# Altium schematic sheet april-demo.SchDoc: April Demos
size Letter; CompanyName: Electric Imp; Address1: Electric Imp; Address2: 5050 El Camino Real, #221; Address3: Los Altos, CA 94022; Address4: United States; Revision: 1; SheetNumber: 1; SheetTotal: 1; PageSetup: Record=PageOptions|CenterHorizontal=True|CenterVertical=True|PrintScale=0.22|XCorrection=1.00|YCorrection=1.00|PrintKind=0|BorderSize=5000000|LeftOffset=0|BottomOffset=0|Orientation=2|PaperLength=1000|PaperWidth=1000|Scale=100|PaperSource=7|PrintQuality=600|MediaType=1|DitherType=10|PaperKind=Tabloid|PrintScaleMode=1
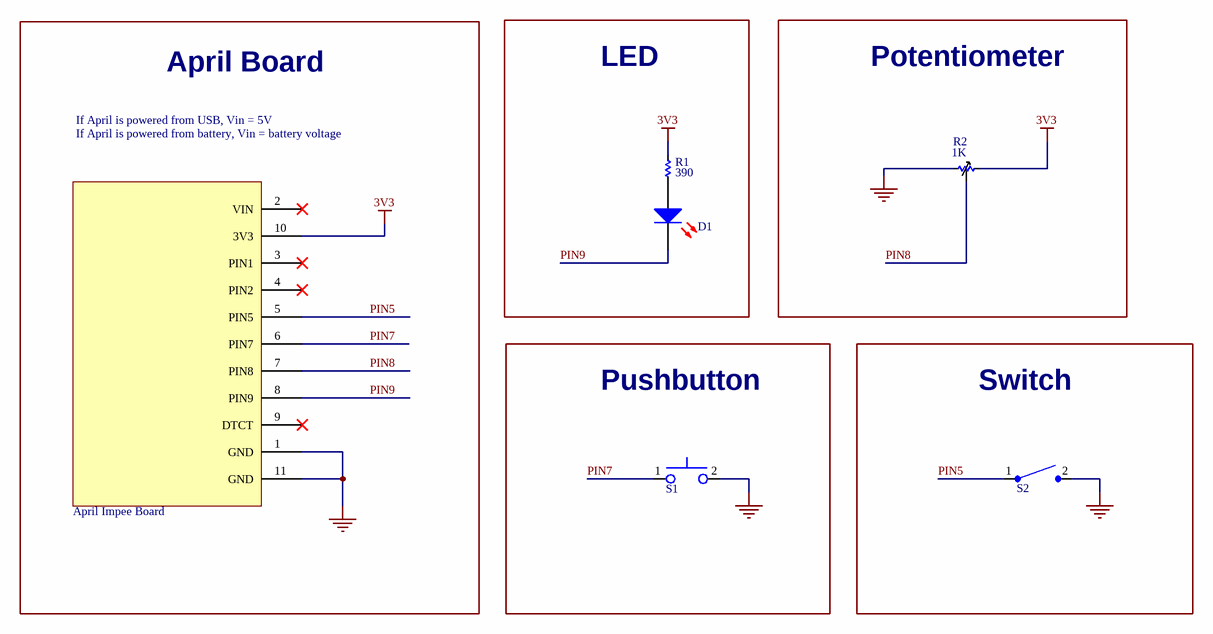
[diagram p0: april-demo.SchDoc]

## Parts
D1  LED Red  (value not drawn)
J1  April Impee Board
R1  value 390  (hidden comment: Resistor)
R2  value 1K  (hidden comment: Potentiometer)
S1  BUTTON  (value not drawn)
S2  SWITCH  (value not drawn)

## Blocks framed on the sheet
April Board: J1
LED: D1 R1
Potentiometer: R2
Pushbutton: S1
Switch: S2

## Nets
3V3: J1.10(3V3) R1.2 R2.3
GND: J1.1(GND) J1.11(GND) R2.1 S1.2(PIN2) S2.2(PIN2)
PIN5: J1.5(PIN5) S2.1(PIN1)
PIN7: J1.6(PIN7) S1.1(PIN1)
PIN8: J1.7(PIN8) R2.2
PIN9: D1.K J1.8(PIN9)
NetD1_A: D1.A R1.1

Not connected (* = marked no-connect by the designer): J1 2(VIN)* 3(PIN1)* 4(PIN2)* 9(DTCT)*

## Notes on the sheet
- If April is powered from USB, Vin = 5V
- If April is powered from battery, Vin = battery voltage

## Library data of the parts
D1 = LED_RED
J1 = APRIL: Electric Imp Breakout Board with Voltage Regulator; Manufacturer Part Number: Impee April; Manufacturer: Electric Imp
R1 = RES
R2 = POT
S1 = BTN-MOMENTARY: SWITCH, PUSHBUTTON, NOMINALLY OFF
S2 = SW-SPST-ON-OFF: Switch, SPST, On-Off